# EAGLE design ExtraCore_2 (EAGLE 6.2)
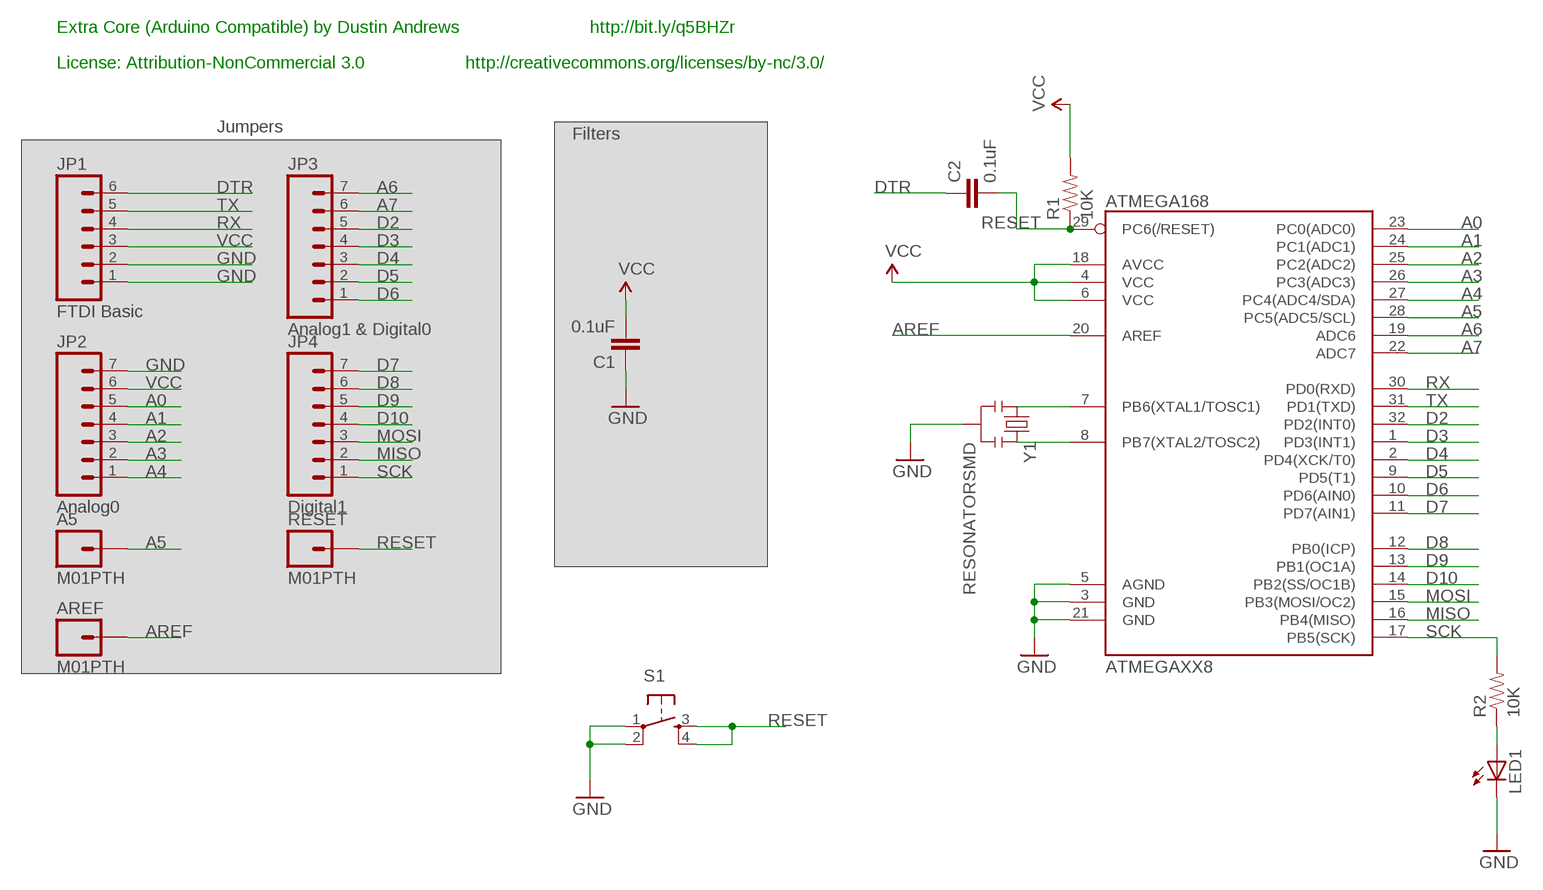
[diagram p0: schematic, sheet 1]

## Parts
A5  M01PTH  [1X01]
AREF  M01PTH  [1X01]
ATMEGAXX8  ATMEGA168  [TQFP32-08]
C1  0.1uF  CAP0805  [0805]
C2  0.1uF  CAP0805  [0805]
JP1  FTDI Basic  M06SIP  [1X06]
JP2  Analog0  M07  [1X07]
JP3  Analog1 & Digital0  M07  [1X07]
JP4  Digital1  M07  [1X07]
LED1  LEDCHIP-LED0805  [CHIP-LED0805]
R1  10K  RESISTOR0805-RES  [0805]
R2  10K  RESISTOR0805-RES  [0805]
RESET  M01PTH  [1X01]
S1  TAC_SWITCHSMD  [TACTILE_SWITCH_SMD]
Y1  RESONATORSMD  [RESONATOR-SMD]

## Nets
A0: ATMEGAXX8.23(PC0(ADC0)) JP2.5
A1: ATMEGAXX8.24(PC1(ADC1)) JP2.4
A2: ATMEGAXX8.25(PC2(ADC2)) JP2.3
A3: ATMEGAXX8.26(PC3(ADC3)) JP2.2
A4: ATMEGAXX8.27(PC4(ADC4/SDA)) JP2.1
A5: A5.1 ATMEGAXX8.28(PC5(ADC5/SCL))
A6: ATMEGAXX8.19(ADC6) JP3.7
A7: ATMEGAXX8.22(ADC7) JP3.6
AREF: AREF.1 ATMEGAXX8.20(AREF)
D2: ATMEGAXX8.32(PD2(INT0)) JP3.5
D3: ATMEGAXX8.1(PD3(INT1)) JP3.4
D4: ATMEGAXX8.2(PD4(XCK/T0)) JP3.3
D5: ATMEGAXX8.9(PD5(T1)) JP3.2
D6: ATMEGAXX8.10(PD6(AIN0)) JP3.1
D7: ATMEGAXX8.11(PD7(AIN1)) JP4.7
D8: ATMEGAXX8.12(PB0(ICP)) JP4.6
D9: ATMEGAXX8.13(PB1(OC1A)) JP4.5
D10: ATMEGAXX8.14(PB2(SS/OC1B)) JP4.4
DTR: C2.1 JP1.6
GND: ATMEGAXX8.3(GND) ATMEGAXX8.5(AGND) ATMEGAXX8.21(GND) C1.1 JP1.1 JP1.2 JP2.7 LED1.C S1.1 S1.2 Y1.2
MISO: ATMEGAXX8.16(PB4(MISO)) JP4.2
MOSI: ATMEGAXX8.15(PB3(MOSI/OC2)) JP4.3
N$3: ATMEGAXX8.7(PB6(XTAL1/TOSC1)) Y1.1
N$4: ATMEGAXX8.8(PB7(XTAL2/TOSC2)) Y1.3
N$6: LED1.A R2.1
RESET: ATMEGAXX8.29(PC6(/RESET)) C2.2 R1.1 RESET.1 S1.3 S1.4
RX: ATMEGAXX8.30(PD0(RXD)) JP1.4
SCK: ATMEGAXX8.17(PB5(SCK)) JP4.1 R2.2
TX: ATMEGAXX8.31(PD1(TXD)) JP1.5
VCC: ATMEGAXX8.4(VCC) ATMEGAXX8.6(VCC) ATMEGAXX8.18(AVCC) C1.2 JP1.3 JP2.6 R1.2

## Notes on the sheet
- Extra Core (Arduino Compatible) by Dustin Andrews | http://bit.ly/q5BHZr
- License: Attribution-NonCommercial 3.0 | http://creativecommons.org/licenses/by-nc/3.0/
- Jumpers
- Filters

## Library data of the parts
A5 AREF RESET = SparkFun:M01: Header 1 Standard 1-pin 0.1" header. Use with straight break away headers (SKU : PRT-00116), right angle break away headers (PRT-00553), swiss pins (PRT-00743), machine pins (PRT-00117), and female headers (PRT-00115).
ATMEGAXX8 = SparkFun:ATMEGA168
C1 C2 = SparkFun:CAP: Capacitor Standard 0603 ceramic capacitor, and 0.1" leaded capacitor.
JP1 = SparkFun:M06: Header 6 Standard 6-pin 0.1" header. Use with straight break away headers (SKU : PRT-00116), right angle break away headers (PRT-00553), swiss pins (PRT-00743), machine pins (PRT-00117), and female headers (PRT-00115). Molex polarized connector foot print use with SKU : PRT-08094 with associated crimp pins and housings. NOTES ON THE VARIANTS LOCK and LOCK_LONGPADS... This footprint was designed to help hold the alignment of a through-hole component (i.e. 6-pin header) while soldering it into place. You may notice that each hole has been shifted either up or down by 0.005 of an inch from it's more standard position (which is a perfectly straight line). This slight alteration caused the pins (the squares in the middle) to touch the edges of the holes. Because they are alternating, it causes a "brace" to hold the component in place. 0.005 has proven to be the perfect amount of "off-center" position when using our standard breakaway headers. Although looks a little odd when you look at the bare footprint, once you have a header in there, the alteration is very hard to notice. Also, if you push a header all the way into place, it is covered up entirely on the bottom side. This idea of altering the position of holes to aid alignment will be further integrated into the Sparkfun Library for other footprints. It can help hold any component with 3 or more connection pins.
JP2-JP4 = SparkFun:M07: Header 7 Standard 7-pin 0.1" header. Use with straight break away headers (SKU : PRT-00116), right angle break away headers (PRT-00553), swiss pins (PRT-00743), machine pins (PRT-00117), and female headers (PRT-00115). NOTES ON THE VARIANTS LOCK and LOCK_LONGPADS... This footprint was designed to help hold the alignment of a through-hole component (i.e. 7-pin header) while soldering it into place. You may notice that each hole has been shifted either up or down by 0.005 of an inch from it's more standard position (which is usually a perfectly straight line). This slight alteration caused the pins (the squares in the middle) to touch the edges of the holes. Because they are alternating, it causes a "brace" to hold the header in place. 0.005 has proven to be the perfect amount of "off-center" position when using our standard breakaway headers. Although looks a little odd when you look at the bare footprint, once you have a header in there, the alteration is very hard to notice. Also, if you push a header all the way into place, it is covered up entirely on the bottom side. This idea of altering the position of holes to aid alignment will be further integrated into the Sparkfun Library for other footprints. It can help hold any component with 3 or more connection pins.
LED1 = adafruit:LED: LED OSRAM: - CHIPLED LG R971, LG N971, LY N971, LG Q971, LY Q971, LO R971, LY R971 LH N974, LH R974 LS Q976, LO Q976, LY Q976 LO Q996 - Hyper CHIPLED LW Q18S LB Q993, LB Q99A, LB R99A - SideLED LS A670, LO A670, LY A670, LG A670, LP A670 LB A673, LV A673, LT A673, LW A673 LH A674 LY A675 LS A676, LA A676, LO A676, LY A676, LW A676 LS A679, LY A679, LG A679 - Hyper Micro SIDELED® LS Y876, LA Y876, LO Y876, LY Y876 LT Y87S - SmartLED LW L88C, LW L88S LB L89C, LB L89S, LG L890 LS L89K, LO L89K, LY L89K LS L896, LA L896, LO L896, LY L896 - TOPLED LS T670, LO T670, LY T670, LG T670, LP T670 LSG T670, LSP T670, LSY T670, LOP T670, LYG T670 LG T671, LOG T671, LSG T671 LB T673, LV T673, LT T673, LW T673 LH T674 LS T676, LA T676, LO T676, LY T676, LB T676, LH T676, LSB T676, LW T676 LB T67C, LV T67C, LT T67C, LS T67K, LO T67K, LY T67K, LW E67C LS E67B, LA E67B, LO E67B, LY E67B, LB E67C, LV E67C, LT E67C LW T67C LS T679, LY T679, LG T679 LS T770, LO T770, LY T770, LG T770, LP T770 LB T773, LV T773, LT T773, LW T773 LH T774 LS E675, LA E675, LY E675, LS T675 LS T776, LA T776, LO T776, LY T776, LB T776 LHGB T686 LT T68C, LB T68C - Hyper Mini TOPLED® LB M676 - Mini TOPLED Santana® LG M470 LS M47K, LO M47K, LY M47K Source: http://www.osram.convergy.de/
R1 R2 = SparkFun:RESISTOR: Resistor Basic schematic elements and footprints for 0603, 1206, and PTH resistors.
S1 = SparkFun:TAC_SWITCH: Momentary Switch Button commonly used for reset or general input. Spark Fun Electronics SKU : COM-00097
Y1 = SparkFun:RESONATOR: Resonator Small SMD resonator. This is the itty bitty 10/20MHz resonators with built in caps. CSTCE10M0G55 and CSTCE20M0V53. Footprint has been reviewed closely but hasn't been tested yet.

## Board
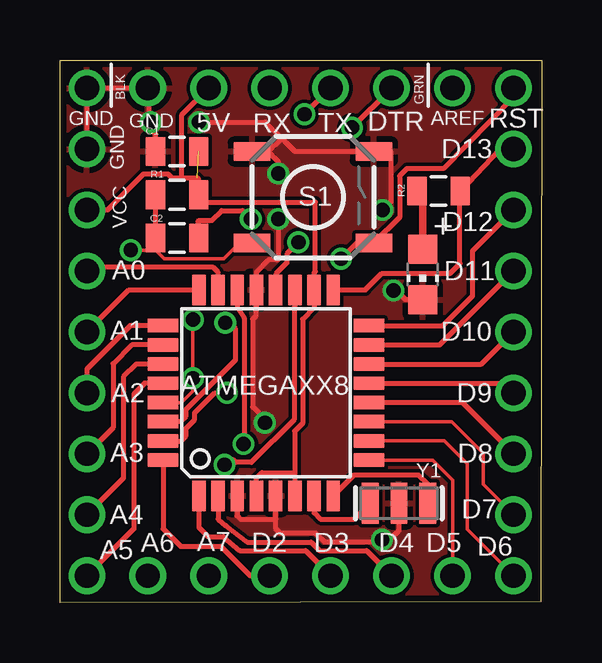
[diagram p1: board, top side]
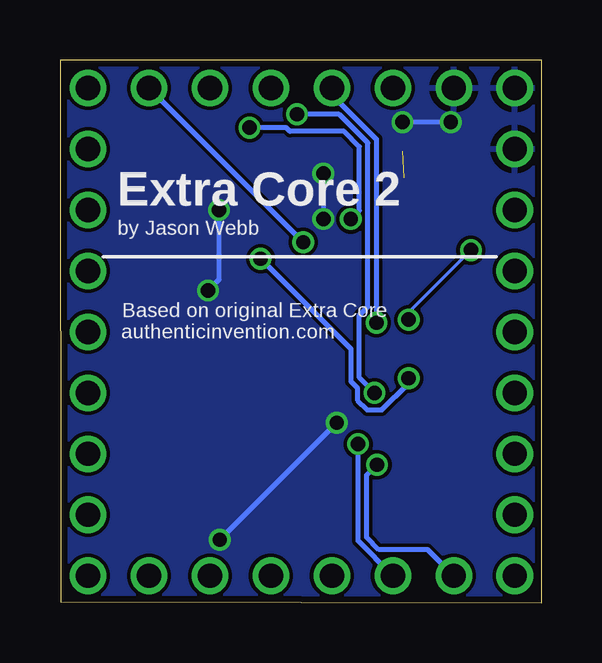
[diagram p2: board, bottom side, seen from below]

Size 20.07 x 22.61 mm. Coordinates in mm from the lower left corner, seen from the top.
Outline: 0,0 0,22.61 20.07,22.61 20.04,0.03 0,0
Copper layers (1*16): Top 0.035mm / dielectric 1.5mm / Bottom 0.035mm
Design rules: minimum track width 6mil, minimum drill 12mil, track to track 6mil, track to pad 6mil, pad to pad 6mil, via to via 6mil, smd to smd 0mil, copper to edge 10mil, drill to drill 10mil, minimum pad ring 10mil, minimum via ring 6mil, stop-mask expansion 2mil, vias tented up to drill 100mil, thermal gap 10mil

### Footprints (pad centres in the part's own frame; a part is rotated, then mirrored left to right if it is on the bottom)
1X01 = drill 1.016 pad 1.422: 1 0,0
TQFP32-08 = smd 1.27 x 0.559: 1 -4.293,2.8; 2 -4.293,2; 3 -4.293,1.2; 4 -4.293,0.4; 5 -4.293,-0.4; 6 -4.293,-1.2; 7 -4.293,-2; 8 -4.293,-2.8; 17 4.293,-2.8; 18 4.293,-2; 19 4.293,-1.2; 20 4.293,-0.4; 21 4.293,0.4; 22 4.293,1.2; 23 4.293,2; 24 4.293,2.8 | smd 0.559 x 1.27: 9 -2.8,-4.293; 10 -2,-4.293; 11 -1.2,-4.293; 12 -0.4,-4.293; 13 0.4,-4.293; 14 1.2,-4.293; 15 2,-4.293; 16 2.8,-4.293; 25 2.8,4.293; 26 2,4.293; 27 1.2,4.293; 28 0.4,4.293; 29 -0.4,4.293; 30 -1.2,4.293; 31 -2,4.293; 32 -2.8,4.293
0805 = smd 0.8 x 1.2: 1 -0.9,0; 2 0.9,0
1X06 = drill 1.016 pad 1.422: 1 0,0; 2 2.54,0; 3 5.08,0; 4 7.62,0; 5 10.16,0; 6 12.7,0
1X07 = drill 1.016 pad 1.422: 1 0,0; 2 2.54,0; 3 5.08,0; 4 7.62,0; 5 10.16,0; 6 12.7,0; 7 15.24,0
CHIP-LED0805 = smd 1.2 x 1.2: A 0,-1.05; C 0,1.05
TACTILE_SWITCH_SMD = smd 1.524 x 0.762: 1 -2.54,1.905; 2 2.54,1.905; 3 -2.54,-1.905; 4 2.54,-1.905
RESONATOR-SMD = smd 0.7 x 1.7: 1 -1.2,0; 2 0,0; 3 1.2,0

### Placement (x,y rotation side)
A5  1.12,1.12 0 top
AREF  16.36,21.44 0 top
ATMEGAXX8  8.59,8.74 90 top
C1  4.88,18.8 0 top
C2  4.88,15.19 180 top
JP1  1.12,21.44 0 top
JP2  1.12,3.66 90 top
JP3  18.9,1.12 180 top
JP4  18.9,18.9 270 top
LED1  15.11,13.67 180 top
R1  4.88,16.99 0 top
R2  15.77,17.14 0 top
RESET  18.9,21.44 0 top
S1  10.54,16.89 0 top
Y1  14.12,4.14 0 top

### Tracks (layer width: path | path; a pad name or v marks a point on that pad's centre or on a via)
A0
  Top 0.203: ATMEGAXX8.23 6.58,13.76 6.38,13.97 1.29,13.97 JP2.5
A1
  Top 0.203: JP2.4 2.87,13.03 ATMEGAXX8.24
A2
  Top 0.203: ATMEGAXX8.25 2.93,11.54 1.12,9.73 JP2.3
A3
  Top 0.203: ATMEGAXX8.26 2.99,10.74 2.21,9.96 2.21,7.29 JP2.2
A4
  Top 0.203: ATMEGAXX8.27 3.18,9.94 2.64,9.4 2.64,5.18 JP2.1
A5
  Top 0.203: ATMEGAXX8.28 3.52,9.14 3.07,8.69 3.07,3.07 A5.1
A6  (via drill 0.6)
  Top 0.203: v6.86,5.74 6.86,5.94 7.21,5.94 7.32,5.84 7.98,5.84 9.75,7.62 9.75,12.29 9.78,12.32 ATMEGAXX8.19
  Bottom 0.203: v6.86,5.74 7.29,5.31 7.29,2.72 6.78,2.21 4.75,2.21 JP3.7
A7  (via drill 0.6)
  Top 0.203: v7.64,6.6 7.67,6.55 7.67,11.86 7.39,12.29 ATMEGAXX8.22
  Bottom 0.203: v7.64,6.6 7.64,2.56 JP3.6
AREF  (via drill 0.6)
  Top 0.203: v9.93,15.01 9.45,14.53 9.45,14.15 8.99,13.69 ATMEGAXX8.20
  Bottom 0.203: AREF.1 v9.93,15.01
D2
  Top 0.203: ATMEGAXX8.32 4.29,3.07 5.03,2.34 6.71,2.34 7.92,1.12 JP3.5
D3
  Top 0.203: ATMEGAXX8.1 5.79,3.13 6.17,2.74 6.81,2.74 7.49,2.16 10.24,2.16 JP3.4
D4
  Top 0.203: ATMEGAXX8.2 6.58,3.47 6.91,3.2 7.8,2.52 10.46,2.52 10.82,2.16 12.78,2.16 JP3.3
D5
  Top 0.152: ATMEGAXX8.9 15.53,5.94 16.36,5.11 JP3.2
D6
  Top 0.152: ATMEGAXX8.10 16.02,6.74 16.97,5.79 16.97,3.05 JP3.1
D7
  Top 0.152: ATMEGAXX8.11 16.31,7.54 17.63,6.22 17.63,4.93 JP4.7
D8
  Top 0.203: ATMEGAXX8.12 16.76,8.34 JP4.6
D9
  Top 0.203: ATMEGAXX8.13 18.5,9.14 JP4.5
D10
  Top 0.203: ATMEGAXX8.14 17.56,9.94 JP4.4
DTR  (via drill 0.6)
  Top 0.203: v12.17,19.79 JP1.6 | v7.95,15.98 7.59,16.33 6.73,16.33 6.33,15.93 5.79,15.93 5.77,15.9 5.77,15.19 C2.1
  Bottom 0.203: v12.17,19.79 10.64,19.79 10.49,19.63 8.23,19.63 7.59,19 7.59,16.33 v7.95,15.98
GND  (via drill 0.6)
  Top 0.203: Y1.2 14.12,3 13.64,2.52 13.41,2.52 | 13.41,2.52 11.02,2.52 10.64,2.9 9.17,2.9 8.99,3.07 8.99,3.48 | 8.99,3.48 ATMEGAXX8.5 | ATMEGAXX8.3 7.38,3.61 7.52,3.48 8.99,3.48 | JP2.7 JP1.1 JP1.2 3.71,21.36 3.71,20.02 | v8.53,7.49 8.53,7.64 8.03,8.15 8.03,11.81 8.15,11.94 8.15,12.29 8.18,12.32 ATMEGAXX8.21 8.18,13.11 8.18,13.77 8.69,14.28 9.07,14.28 9.09,14.3 v9.09,15.98 | v13.41,2.62 13.41,2.52 | 3.71,20.02 3.71,19.79 3.99,19.51 C1.1 | 9.23,19.34 8.56,20.02 v5.79,20.02 | 9.23,19.34 9.78,18.8 S1.2 13.74,18.8 13.79,18.75 13.79,16.71 v13.44,16.36 | v3.79,20.02 3.71,20.02 | 9.23,19.34 8.69,18.8 S1.1 8.74,18.72 9.09,18.36 v9.09,17.88 | v13.89,13.01 14.02,13.01 14.4,12.62 LED1.C
  Bottom 0.203: v13.41,2.62 v8.53,7.49 | v3.79,20.02 v5.79,20.02 | v9.09,17.88 v9.09,15.98 | v13.44,16.36 13.44,13.46 v13.89,13.01
  pour Bottom: -0.25,-0.25 20.32,-0.25 20.32,22.86 -0.25,22.86
  pour Top: -0.25,-0.25 20.32,-0.25 20.32,22.86 -0.25,22.86
MISO
  Top 0.203: ATMEGAXX8.16 15.96,11.54 17.2,12.78 17.2,14.66 JP4.2
MOSI
  Top 0.203: ATMEGAXX8.15 15.82,10.74 JP4.3
N$3
  Top 0.203: ATMEGAXX8.7 10.59,3.74 10.85,3.48 12.26,3.48 Y1.1
N$4
  Top 0.203: Y1.3 15.32,4.92 14.94,5.31 12.25,5.31 ATMEGAXX8.8
N$6
  Top 0.305: R2.1 15.11,17.14 LED1.A
RESET  (via drill 0.6)
  Top 0.152: v5.54,11.79 v5.54,9.35 5.54,8.81 5.05,8.33 ATMEGAXX8.29 | v2.95,14.68 3.94,14.68 3.96,14.71 | 3.96,14.71 3.96,15.14 C2.2 | S1.3 7.47,14.96 6.83,14.33 4.34,14.33 3.96,14.71
  Top 0.203: R1.1 C2.2 | RESET.1 18.9,21.08 15.98,18.09 14.45,18.09 14.15,17.78 14.15,16.05 S1.4 12.37,14.99 v11.71,14.33
  Bottom 0.152: v5.54,11.79 5.54,12.09 v2.95,14.68
  Bottom 0.203: v5.54,9.35 5.54,9.14 6.66,8.03 7.26,8.03 7.67,8.43 7.67,8.94 7.95,9.22 7.95,10.57 v11.71,14.33
RX  (via drill 0.6)
  Top 0.203: ATMEGAXX8.30 5.03,7.54 5.26,7.77 5.26,8.05 7.32,10.11 7.32,11.4 7.06,11.66 v6.88,11.66
  Bottom 0.203: v6.88,11.66 6.88,19.3 8.74,21.16 JP1.4
SCK
  Top 0.203: JP4.1 18.33,18.9 R2.2 16.66,14.12 16.26,13.72 13.41,13.72 12.72,13.03 ATMEGAXX8.17
TX  (via drill 0.6)
  Top 0.203: v10.19,20.34 JP1.5 | v6.96,8.74 6.45,8.74 5.61,7.9 5.61,7.62 5.26,7.26 5.26,6.96 5.03,6.73 ATMEGAXX8.31
  Bottom 0.203: v10.19,20.34 8.43,20.34 7.24,19.15 7.24,12.32 7.59,11.96 7.59,9.37 v6.96,8.74
VCC  (1 unrouted)
  Top 0.203: 9.78,5.41 9.78,7.14 10.11,7.47 10.11,11.81 10.59,12.29 ATMEGAXX8.18 10.59,13.11 10.59,13.74 10.64,13.79 10.64,16.69 5.77,16.69 5.77,16.89 R1.2 5.77,17.09 5.77,17.65 5.71,17.7 5.05,17.7 | 9.78,5.41 ATMEGAXX8.6 | 9.78,5.41 8.41,5.41 8.18,5.18 ATMEGAXX8.4 | 5.05,17.7 4.65,17.7 4.5,17.86 3.48,17.86 1.98,16.36 JP2.6 | 5.05,17.7 5.05,20.3 JP1.3

### Text on the board
tPlace: GRN | BLK | AREF | GND | GND | 5V | RX | TX | DTR | RST | D13 | GND | VCC | D12 | A0 | D11 | A1 | D10 | A2 | D9 | A3 | D8 | D7 | A4 | A5 | A6 | D2 | A7 | D3 | D4 | D5 | D6
bPlace: Extra Core 2 | by Jason Webb | Based on original Extra Core | authenticinvention.com